# Altium schematic sheet ICAN-7006-IO.SchDoc
size A3; PageSetup: Record=PageOptions|CenterHorizontal=True|CenterVertical=True|PrintScale=1.04|XCorrection=1.00|YCorrection=1.00|PrintKind=0|BorderSize=5000000|LeftOffset=0|BottomOffset=0|Orientation=2|PaperLength=1000|PaperWidth=1000|Scale=100|PaperSource=7|PrintQuality=-4|MediaType=1|DitherType=10|PaperKind=A3|PrintScaleMode=1
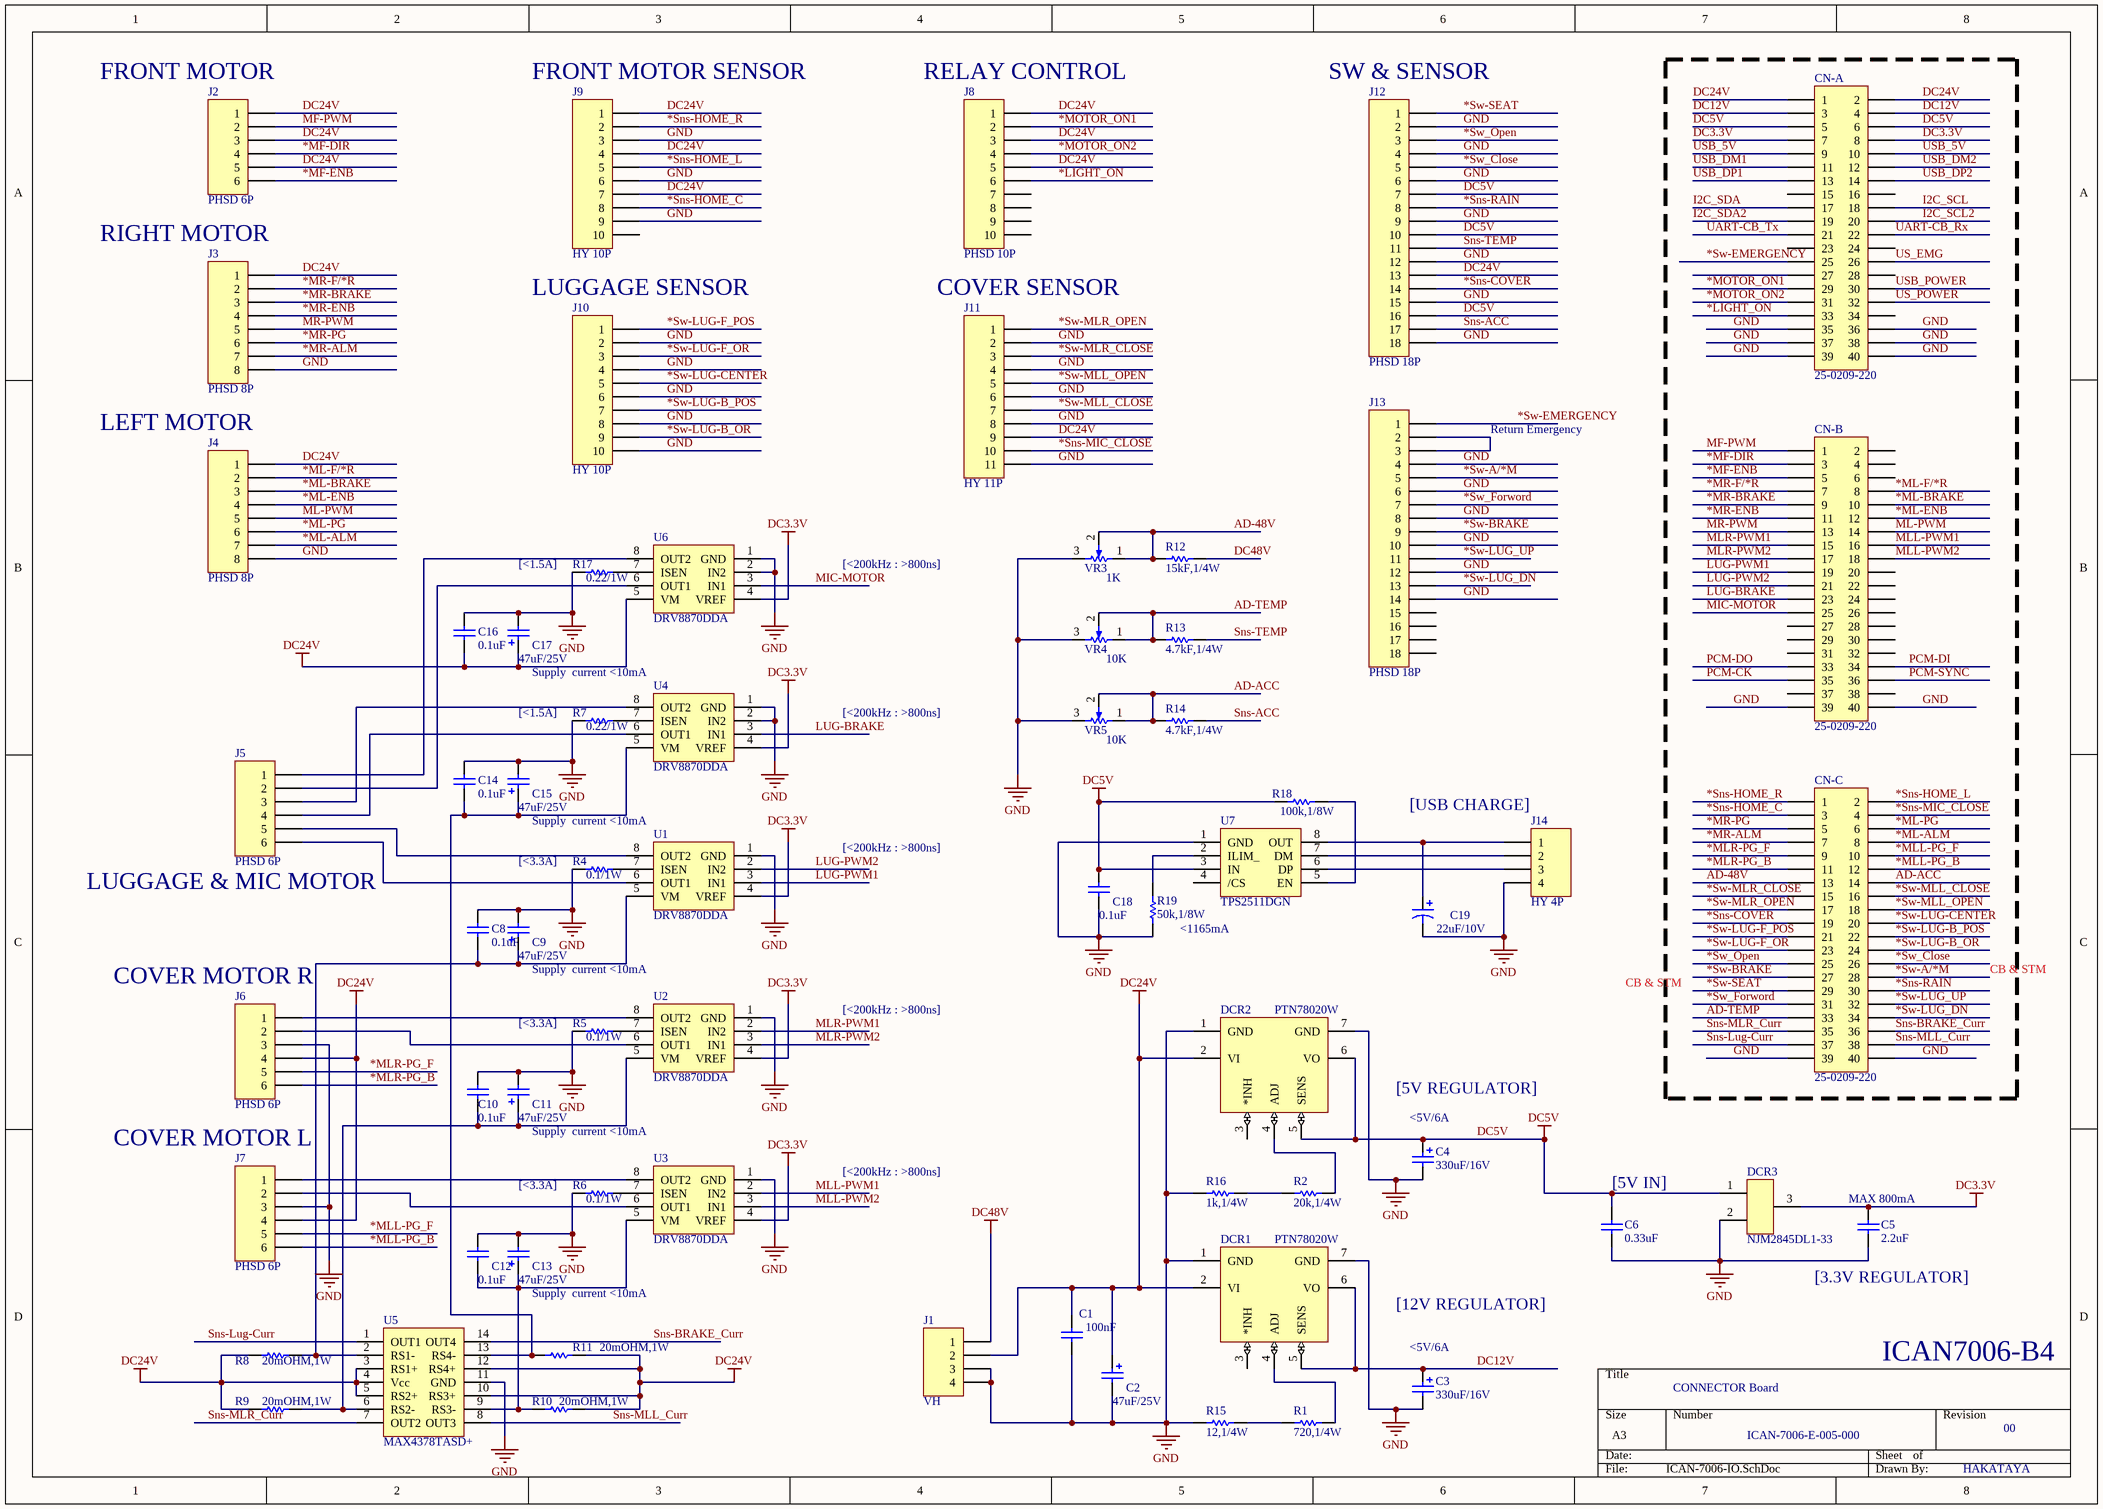
[diagram p0: ICAN-7006-IO.SchDoc]

## Parts
C1  100nF  [[0805]2012]
C2  47uF/25V  [Capa MH5 PITCH2.5mm]
C3  330uF/16V  [CAPA WXA PITCH 3.5mm]
C4  330uF/16V  [CAPA WXA PITCH 3.5mm]
C5  2.2uF  [[0805]2012]
C6  0.33uF  [[0805]2012]
C8  0.1uF  [[0805]2012]
C9  47uF/25V  [Capa MH5 PITCH2.5mm]
C10  0.1uF  [[0805]2012]
C11  47uF/25V  [Capa MH5 PITCH2.5mm]
C12  0.1uF  [[0805]2012]
C13  47uF/25V  [Capa MH5 PITCH2.5mm]
C14  0.1uF  [[0805]2012]
C15  47uF/25V  [Capa MH5 PITCH2.5mm]
C16  0.1uF  [[0805]2012]
C17  47uF/25V  [Capa MH5 PITCH2.5mm]
C18  0.1uF  [[0805]2012]
C19  22uF/10V  [[0805]2012]
CN-A  25-0209-220  [HDR2X20]
CN-B  25-0209-220  [HDR2X20]
CN-C  25-0209-220  [HDR2X20]
DCR1  PTN78020W  [PTN78020]
DCR2  PTN78020W  [PTN78020]
DCR3  NJM2845DL1-33  [TO-252-3]
J1  VH  [VH-S4]
J2  PHSD 6P  [PHSD WV03x2]
J3  PHSD 8P  [PHSD WV04x2]
J4  PHSD 8P  [PHSD WV04x2]
J5  PHSD 6P  [PHSD WV03x2]
J6  PHSD 6P  [PHSD WV03x2]
J7  PHSD 6P  [PHSD WV03x2]
J8  PHSD 10P  [PHSD WV05x2]
J9  HY 10P  [HY-10A]
J10  HY 10P  [HY-10A]
J11  HY 11P  [HY-11A]
J12  PHSD 18P  [PHSD WV09X2]
J13  PHSD 18P  [PHSD WV09X2]
J14  HY 4P  [HY-4A]
R1  720,1/4W  [[1206]3216]
R2  20k,1/4W  [[1206]3216]
R4  0.1/1W  [[1206]3216]
R5  0.1/1W  [[1206]3216]
R6  0.1/1W  [[1206]3216]
R7  0.22/1W  [[1206]3216]
R8  20mOHM,1W  [6332[2512]]
R9  20mOHM,1W  [6332[2512]]
R10  20mOHM,1W  [6332[2512]]
R11  20mOHM,1W  [6332[2512]]
R12  15kF,1/4W  [[1206]3216]
R13  4.7kF,1/4W  [[1206]3216]
R14  4.7kF,1/4W  [[1206]3216]
R15  12,1/4W  [[1206]3216]
R16  1k,1/4W  [[1206]3216]
R17  0.22/1W  [[1206]3216]
R18  100k,1/8W  [[0805]2012]
R19  50k,1/8W  [[0805]2012]
U1  DRV8870DDA  [D008_L]
U2  DRV8870DDA  [D008_L]
U3  DRV8870DDA  [D008_L]
U4  DRV8870DDA  [D008_L]
U5  MAX4378TASD+  [SOIC150-14_L]
U6  DRV8870DDA  [D008_L]
U7  TPS2511DGN  [DGN 8P]
VR3  1K  [VR]
VR4  10K  [VR]
VR5  10K  [VR]

## Blocks framed on the sheet
CB & STM: CN-A CN-B CN-C

## Nets
DC3.3V: C5.2 CN-A.7 CN-A.8 DCR3.3 U1.4(VREF) U2.4(VREF) U3.4(VREF) U4.4(VREF) U6.4(VREF)
DC5V: C4.1 C6.2 C18.2 CN-A.5 CN-A.6 DCR2.5(SENS) DCR2.6(VO) DCR3.1 J12.7 J12.10 J12.16 R18.1 U7.3(IN)
DC24V: C1.2 C2.1 C16.1 C17.1 CN-A.1 CN-A.2 DCR1.2(VI) DCR2.2(VI) J1.2 J2.1 J2.3 J2.5 J3.1 J4.1 J6.4 J7.4 J8.1 J8.3 J8.5 J9.1 J9.4 J9.7 J11.9 J12.13 R8.1 R9.1 R10.2 R11.2 U5.3(RS1+) U5.4(Vcc) U5.5(RS2+) U5.10(RS3+) U5.12(RS4+) U6.5(VM)
DC48V: J1.1 R12.2
GND: C1.1 C2.2 C3.2 C4.2 C5.1 C6.1 C8.2 C9.2 C10.2 C11.2 C12.2 C13.2 C14.2 C15.2 C16.2 C17.2 C18.1 C19.2 CN-A.35 CN-A.36 CN-A.37 CN-A.38 CN-A.39 CN-A.40 CN-B.39 CN-B.40 CN-C.39 CN-C.40 DCR1.1(GND) DCR1.7(GND) DCR2.1(GND) DCR2.7(GND) DCR3.2 J1.3 J1.4 J3.8 J4.8 J6.3 J7.3 J9.3 J9.6 J9.9 J10.2 J10.4 J10.6 J10.8 J10.10 J11.2 J11.4 J11.6 J11.8 J11.11 J12.2 J12.4 J12.6 J12.9 J12.12 J12.15 J12.18 J13.4 J13.6 J13.8 J13.10 J13.12 J13.14 J14.4 R4.1 R5.1 R6.1 R7.1 R15.1 R16.1 R17.1 R19.1 U1.1(GND) U2.1(GND) U3.1(GND) U4.1(GND) U4.2(IN2) U5.11(GND) U6.1(GND) U6.2(IN2) U7.1(GND) VR3.3 VR4.3 VR5.3
*LIGHT_ON: CN-A.33 J8.6
*MF-DIR: CN-B.3 J2.4
*MF-ENB: CN-B.5 J2.6
*ML-ALM: CN-C.8 J4.7
*ML-BRAKE: CN-B.10 J4.3
*ML-ENB: CN-B.12 J4.4
*ML-F/*R: CN-B.8 J4.2
*ML-PG: CN-C.6 J4.6
*MLL-PG_B: CN-C.12 J7.6
*MLL-PG_F: CN-C.10 J7.5
*MLR-PG_B: CN-C.11 J6.6
*MLR-PG_F: CN-C.9 J6.5
*MOTOR_ON1: CN-A.29 J8.2
*MOTOR_ON2: CN-A.31 J8.4
*MR-ALM: CN-C.7 J3.7
*MR-BRAKE: CN-B.9 J3.3
*MR-ENB: CN-B.11 J3.4
*MR-F/*R: CN-B.7 J3.2
*MR-PG: CN-C.5 J3.6
*Sns-COVER: CN-C.19 J12.14
*Sns-HOME_C: CN-C.3 J9.8
*Sns-HOME_L: CN-C.2 J9.5
*Sns-HOME_R: CN-C.1 J9.2
*Sns-MIC_CLOSE: CN-C.4 J11.10
*Sns-RAIN: CN-C.30 J12.8
*Sw-A/*M: CN-C.28 J13.5
*Sw-BRAKE: CN-C.27 J13.9
*Sw-EMERGENCY: CN-A.25 J13.1
*Sw-LUG-B_OR: CN-C.24 J10.9
*Sw-LUG-B_POS: CN-C.22 J10.7
*Sw-LUG-CENTER: CN-C.20 J10.5
*Sw-LUG-F_OR: CN-C.23 J10.3
*Sw-LUG-F_POS: CN-C.21 J10.1
*Sw-LUG_DN: CN-C.34 J13.13
*Sw-LUG_UP: CN-C.32 J13.11
*Sw-MLL_CLOSE: CN-C.16 J11.7
*Sw-MLL_OPEN: CN-C.18 J11.5
*Sw-MLR_CLOSE: CN-C.15 J11.3
*Sw-MLR_OPEN: CN-C.17 J11.1
*Sw-SEAT: CN-C.29 J12.1
*Sw_Close: CN-C.26 J12.5
*Sw_Forword: CN-C.31 J13.7
*Sw_Open: CN-C.25 J12.3
AD-48V: CN-C.13 R12.1 VR3.1 VR3.2
AD-ACC: CN-C.14 R14.1 VR5.1 VR5.2
AD-TEMP: CN-C.33 R13.1 VR4.1 VR4.2
DC12V: C3.1 CN-A.3 CN-A.4 DCR1.5(SENS) DCR1.6(VO)
I2C_SCL: CN-A.18
I2C_SCL2: CN-A.20
I2C_SDA: CN-A.17
I2C_SDA2: CN-A.19
LUG-BRAKE: CN-B.23 U4.3(IN1)
LUG-PWM1: CN-B.19 U1.3(IN1)
LUG-PWM2: CN-B.21 U1.2(IN2)
MF-PWM: CN-B.1 J2.2
MIC-MOTOR: CN-B.25 U6.3(IN1)
ML-PWM: CN-B.14 J4.5
MLL-PWM1: CN-B.16 U3.2(IN2)
MLL-PWM2: CN-B.18 U3.3(IN1)
MLR-PWM1: CN-B.15 U2.2(IN2)
MLR-PWM2: CN-B.17 U2.3(IN1)
MR-PWM: CN-B.13 J3.5
PCM-CK: CN-B.35
PCM-DI: CN-B.34
PCM-DO: CN-B.33
PCM-SYNC: CN-B.36
Sns-ACC: J12.17 R14.2
Sns-BRAKE_Curr: CN-C.36 U5.14(OUT4)
Sns-Lug-Curr: CN-C.37 U5.1(OUT1)
Sns-MLL_Curr: CN-C.38 U5.8(OUT3)
Sns-MLR_Curr: CN-C.35 U5.7(OUT2)
Sns-TEMP: J12.11 R13.2
UART-CB_Rx: CN-A.22
UART-CB_Tx: CN-A.21
US_EMG: CN-A.26
US_POWER: CN-A.32
USB_5V: CN-A.9 CN-A.10
USB_DM1: CN-A.11
USB_DM2: CN-A.12
USB_DP1: CN-A.13
USB_DP2: CN-A.14
USB_POWER: CN-A.30
NetC8_1: C8.1 C9.1 R8.2 U1.5(VM) U5.2(RS1-)
NetC10_1: C10.1 C11.1 R9.2 U2.5(VM) U5.6(RS2-)
NetC12_1: C12.1 C13.1 R10.1 U3.5(VM) U5.9(RS3-)
NetC14_1: C14.1 C15.1 R11.1 U4.5(VM) U5.13(RS4-)
NetC19_1: C19.1 J14.1 U7.8(OUT)
NetDCR1_4: DCR1.4(ADJ) R1.2
NetDCR2_4: DCR2.4(ADJ) R2.2
NetJ5_1: J5.1 U6.8(OUT2)
NetJ5_2: J5.2 U6.6(OUT1)
NetJ5_3: J5.3 U4.8(OUT2)
NetJ5_4: J5.4 U4.6(OUT1)
NetJ5_5: J5.5 U1.8(OUT2)
NetJ5_6: J5.6 U1.6(OUT1)
NetJ6_1: J6.1 U2.8(OUT2)
NetJ6_2: J6.2 U2.6(OUT1)
NetJ7_1: J7.1 U3.8(OUT2)
NetJ7_2: J7.2 U3.6(OUT1)
NetJ13_2: J13.2 J13.3
NetJ14_2: J14.2 U7.7(DM)
NetJ14_3: J14.3 U7.6(DP)
NetR1_1: R1.1 R15.2
NetR2_1: R2.1 R16.2
NetR4_2: R4.2 U1.7(ISEN)
NetR5_2: R5.2 U2.7(ISEN)
NetR6_2: R6.2 U3.7(ISEN)
NetR7_2: R7.2 U4.7(ISEN)
NetR17_2: R17.2 U6.7(ISEN)
NetR18_2: R18.2 U7.5(EN)
NetR19_2: R19.2 U7.2(ILIM_)

Not connected (* = marked no-connect by the designer): CN-A 15 16 23 24 27 28 34; CN-B 2 4 6 20 22 24 26 27 28 29 30 31 32 37 38; DCR1 3(*INH); DCR2 3(*INH); J8 7 8 9 10; J9 10; J13 15 16 17 18; U7 4(/CS)

## Notes on the sheet
- (near J2) FRONT MOTOR
- (near J9) FRONT MOTOR SENSOR
- (near J8) RELAY CONTROL
- (near J12) SW & SENSOR
- RIGHT MOTOR
- LUGGAGE SENSOR
- COVER SENSOR
- LEFT MOTOR
- Return Emergency
- (near R17) [<1.5A]
- [<200kHz : >800ns]
- (near R7) [<1.5A]
- Supply  current <10mA
- (near J14) [USB CHARGE]
- (near J5) LUGGAGE & MIC MOTOR
- (near R4) [<3.3A]
- (near J6) COVER MOTOR R
- <1165mA
- CB & STM
- (near R5) [<3.3A]
- [5V REGULATOR]
- (near C4) <5V/6A
- COVER MOTOR L
- (near R6) [<3.3A]
- (near C6) [5V IN]
- (near C5) MAX 800mA
- (near C13) Supply  current <10mA
- [12V REGULATOR]
- (near C5) [3.3V REGULATOR]
- (near C3) <5V/6A
- CONNECTOR Board
- ICAN7006-B4
- ICAN-7006-E-005-000
- 00
- HAKATAYA

## Library data of the parts
C1 C8 C10 C12 C14 C16 C18 = Cap: Capacitor; Published: 8-Jun-2000; LatestRevisionDate: 17-Jul-2002; LatestRevisionNote: Re-released for DXP Platform.; PackageReference: RAD-0.3; Publisher: Altium Limited
  C1: Value: 100nF
  C8 C10 C12 C14 C16 C18: Value: 0.1uF
C2-C4 C9 C11 C13 C15 C17 = Cap Pol2: Polarized Capacitor (Axial); Published: 8-Jun-2000; LatestRevisionDate: 17-Jul-2002; LatestRevisionNote: Re-released for DXP Platform.; PackageReference: POLAR0.8; Publisher: Altium Limited
  C2: Value: 47uF/25V; Supplier Part Number: PK 47uF/50V
  C3 C4: Value: 330uF/16V; Supplier Part Number: WXA 330uF/25V
  C9 C11 C13 C15 C17: Value: 47uF/25V; Supplier Part Number: MH5 47uF/25V
C5 C6 = Cap Semi: Capacitor; Published: 8-Jun-2000; LatestRevisionDate: 17-Jul-2002; LatestRevisionNote: Re-released for DXP Platform.; PackageReference: C1206; Publisher: Altium Limited
  C5: Value: 2.2uF
  C6: Value: 0.33uF
C19 = Cap Pol3: Polarized Capacitor (Surface Mount); Published: 8-Jun-2000; LatestRevisionDate: 17-Jul-2002; LatestRevisionNote: Re-released for DXP Platform.; PackageReference: C0805; Publisher: Altium Limited; Value: 22uF/10V
CN-A CN-B CN-C = Header 20X2: Header, 20-Pin, Dual row; LatestRevisionDate: 17-Jul-2002; LatestRevisionNote: Re-released for DXP Platform.; Publisher: Altium Limited; Supplier: Astron Corporation.; URL: http://www.astron.com.tw/product.php?idt=1&pid=68&pno=212; Supplier Part Number: 25-0209-220
DCR1 DCR2 = PTN78020: REGULATOR; Supplier Part Number: PTN78020W
DCR3 = IC3: REGURATOR; Supplier Part Number: NJM2845DL1-33
J1 J14 = Header 4: Header, 4-Pin; LatestRevisionDate: 17-Jul-2002; LatestRevisionNote: Re-released for DXP Platform.; Publisher: Altium Limited
  J1: Supplier Part Number: B4P-VH-FB-B; Supplier: JST
  J14: Supplier Part Number: A2006-04A; Supplier: YOLINK
J2 J5-J7 = Header 6: Header, 6-Pin; LatestRevisionDate: 17-Jul-2002; LatestRevisionNote: Re-released for DXP Platform.; Publisher: Altium Limited; Supplier Part Number: A2006-WV03X2; Supplier: YOLINK
J3 J4 = Header 8: Header, 8-Pin; LatestRevisionDate: 17-Jul-2002; LatestRevisionNote: Re-released for DXP Platform.; Publisher: Altium Limited; Supplier: YOLINK; Supplier Part Number: A2006-WV04X2
J8-J10 = Header 10: Header, 10-Pin; LatestRevisionDate: 17-Jul-2002; LatestRevisionNote: Re-released for DXP Platform.; Publisher: Altium Limited; Supplier: YOLINK
  J8: Supplier Part Number: A2006-WV05X2
  J9 J10: Supplier Part Number: A2006-10A
J11 = Header 11: Header, 11-Pin; LatestRevisionDate: 17-Jul-2002; LatestRevisionNote: Re-released for DXP Platform.; Publisher: Altium Limited; Supplier Part Number: A2006-11A; Supplier Part Number: YOLINK
J12 J13 = Header 18: Header, 18-Pin; LatestRevisionDate: 17-Jul-2002; LatestRevisionNote: Re-released for DXP Platform.; Publisher: Altium Limited; Supplier Part Number: A2006-WV09X2; Supplier: YOLINK
R1 R2 R4-R19 = Res1: Resistor; Published: 8-Jun-2000; LatestRevisionDate: 17-Jul-2002; LatestRevisionNote: Re-released for DXP Platform.; PackageReference: AXIAL-0.3; Publisher: Altium Limited
  R1: Value: 720,1/4W
  R2: Value: 20k,1/4W
  R4-R6: Value: 0.1/1W
  R7 R17: Value: 0.22/1W
  R8-R11: Value: 20mOHM,1W
  R12: Value: 15kF,1/4W
  R13 R14: Value: 4.7kF,1/4W
  R15: Value: 12,1/4W
  R16: Value: 1k,1/4W
  R18: Value: 100k,1/8W
  R19: Value: 50k,1/8W
U1-U4 U6 = IC8-WIDE: Motor Driver; Supplier Part Number: DRV8870DDA
U5 = IC14: Current-Sense; Supplier Part Number: MAX4378TASD+
U7 = IC8-WIDE: Power Switch; Supplier Part Number: TPS2511DGN; Supplier: T.I.; Value: *
VR3-VR5 = RPot SM: Square Trimming Potentiometer; Published: 17-Dec-2003; DatasheetDocument: Oct-2003; PackageReference: POT4MM-2; Publisher: Altium Limited; ComponentLink1Description: Manufacturer Link; ComponentLink1URL: http://bourns.com/2/search.html
  VR3: Value: 1k
  VR4 VR5: Value: 10k